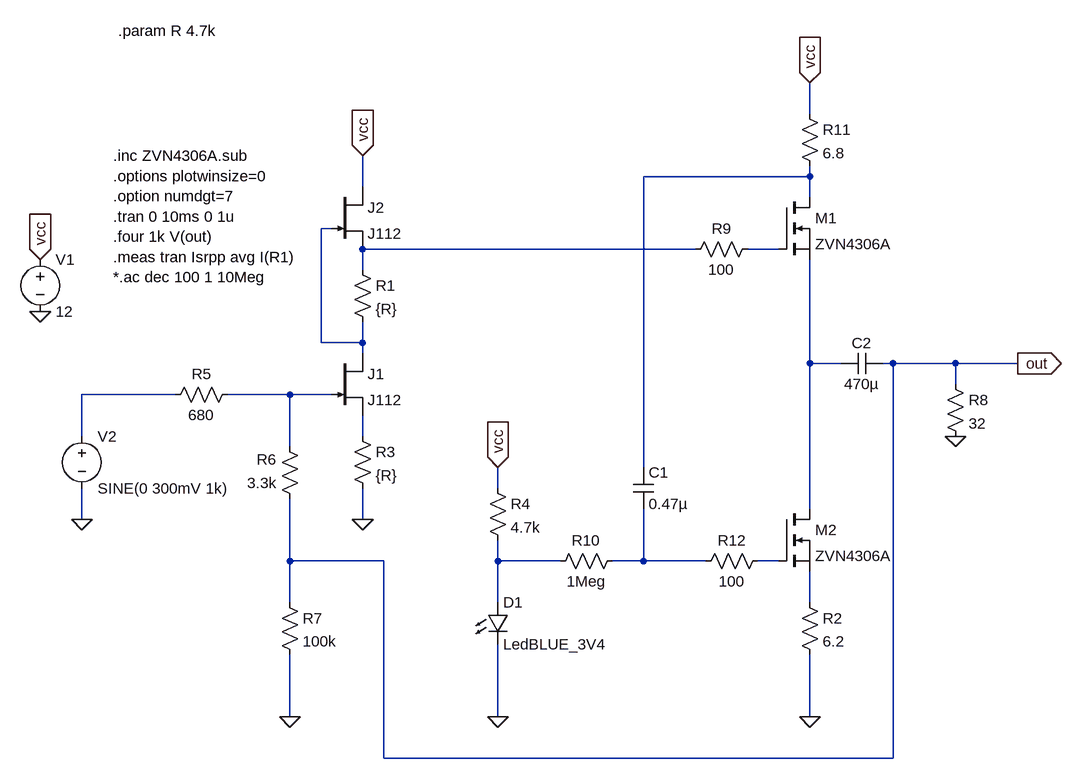
[diagram p0: schematic FET Only.asc]
FET Only.asc, the LTspice schematic file:
Version 4
SHEET 1 1460 884
WIRE 1056 -112 1056 -160
WIRE 1056 -16 1056 -32
WIRE 1056 -16 800 -16
WIRE 368 0 368 -48
WIRE 1056 16 1056 -16
WIRE 320 64 304 64
WIRE 880 96 368 96
WIRE 1008 96 960 96
WIRE 368 128 368 96
WIRE 304 240 304 64
WIRE 368 240 368 208
WIRE 368 240 304 240
WIRE 368 256 368 240
WIRE 1056 272 1056 112
WIRE 1104 272 1056 272
WIRE 1184 272 1168 272
WIRE 1280 272 1184 272
WIRE 1376 272 1280 272
WIRE 1280 304 1280 272
WIRE 80 320 -64 320
WIRE 256 320 160 320
WIRE 320 320 256 320
WIRE -64 384 -64 320
WIRE 368 384 368 352
WIRE 256 400 256 320
WIRE 800 432 800 -16
WIRE 576 464 576 432
WIRE 1056 496 1056 272
WIRE -64 512 -64 464
WIRE 368 512 368 464
WIRE 256 576 256 480
WIRE 400 576 256 576
WIRE 576 576 576 544
WIRE 672 576 576 576
WIRE 800 576 800 496
WIRE 800 576 752 576
WIRE 896 576 800 576
WIRE 1008 576 976 576
WIRE 256 640 256 576
WIRE 576 640 576 576
WIRE 1056 640 1056 592
WIRE 256 816 256 720
WIRE 576 816 576 704
WIRE 1056 816 1056 720
WIRE 400 880 400 576
WIRE 1184 880 1184 272
WIRE 1184 880 400 880
FLAG 368 512 0
FLAG -64 512 0
FLAG -128 112 vcc
IOPIN -128 112 In
FLAG -128 192 0
FLAG 368 -48 vcc
IOPIN 368 -48 In
FLAG 1056 -160 vcc
IOPIN 1056 -160 In
FLAG 1056 816 0
FLAG 576 432 vcc
IOPIN 576 432 In
FLAG 576 816 0
FLAG 1376 272 out
IOPIN 1376 272 Out
FLAG 256 816 0
FLAG 1280 384 0
SYMBOL voltage -64 368 R0
SYMATTR InstName V2
SYMATTR Value SINE(0 300mV 1k)
SYMATTR Value2 AC 1
SYMBOL voltage -128 96 R0
SYMATTR InstName V1
SYMATTR Value 12
SYMBOL res 352 368 R0
SYMATTR InstName R3
SYMATTR Value {R}
SYMBOL njf 320 256 R0
SYMATTR InstName J1
SYMATTR Value J112
SYMBOL res 352 112 R0
SYMATTR InstName R1
SYMATTR Value {R}
SYMBOL njf 320 0 R0
SYMATTR InstName J2
SYMATTR Value J112
SYMBOL res 1040 624 R0
SYMATTR InstName R2
SYMATTR Value 6.2
SYMBOL res 560 448 R0
SYMATTR InstName R4
SYMATTR Value 4.7k
SYMBOL nmos 1008 16 R0
SYMATTR InstName M1
SYMATTR Value ZVN4306A
SYMATTR Prefix X
SYMBOL res 176 304 R90
WINDOW 0 0 56 VBottom 2
WINDOW 3 32 56 VTop 2
SYMATTR InstName R5
SYMATTR Value 680
SYMBOL res 272 496 R180
WINDOW 0 36 76 Left 2
WINDOW 3 36 40 Left 2
SYMATTR InstName R6
SYMATTR Value 3.3k
SYMBOL res 240 624 R0
SYMATTR InstName R7
SYMATTR Value 100k
SYMBOL cap 1168 256 R90
WINDOW 0 0 32 VBottom 2
WINDOW 3 32 32 VTop 2
SYMATTR InstName C2
SYMATTR Value 470µ
SYMBOL res 1264 288 R0
SYMATTR InstName R8
SYMATTR Value 32
SYMBOL res 976 80 R90
WINDOW 0 0 56 VBottom 2
WINDOW 3 32 56 VTop 2
SYMATTR InstName R9
SYMATTR Value 100
SYMBOL res 768 560 R90
WINDOW 0 0 56 VBottom 2
WINDOW 3 32 56 VTop 2
SYMATTR InstName R10
SYMATTR Value 1Meg
SYMBOL res 1040 -128 R0
SYMATTR InstName R11
SYMATTR Value 6.8
SYMBOL cap 784 432 R0
SYMATTR InstName C1
SYMATTR Value 0.47µ
SYMBOL nmos 1008 496 R0
SYMATTR InstName M2
SYMATTR Value ZVN4306A
SYMATTR Prefix X
SYMBOL LED 560 640 R0
SYMATTR InstName D1
SYMATTR Value LedBLUE_3V4
SYMBOL res 992 560 R90
WINDOW 0 0 56 VBottom 2
WINDOW 3 32 56 VTop 2
SYMATTR InstName R12
SYMATTR Value 100
TEXT -16 -48 Left 2 !.inc ZVN4306A.sub\n.options plotwinsize=0\n.option numdgt=7\n.tran 0 10ms 0 1u\n.four 1k V(out)\n.meas tran Isrpp avg I(R1)\n*.ac dec 100 1 10Meg
TEXT -8 -240 Left 2 !.param R 4.7k

The netlist it stands for:
* FET Only.asc
V2 N006 0 SINE(0 300mV 1k) AC 1
V1 vcc 0 12
R3 N008 0 {R}
J1 N002 N007 N008 J112
R1 N003 N002 {R}
J2 vcc N002 N003 J112
R2 N012 0 6.2
R4 vcc N009 4.7k
XM1 N001 N004 N005 ZVN4306A  ; pins D G S
R5 N007 N006 680
R6 out N007 3.3k
R7 out 0 100k
C2 out N005 470µ
R8 out 0 32
R9 N004 N003 100
R10 N010 N009 1Meg
R11 vcc N001 6.8
C1 N001 N010 0.47µ
XM2 N005 N011 N012 ZVN4306A  ; pins D G S
D1 N009 0 LedBLUE_3V4
R12 N011 N010 100
.model D D
.lib standard.dio
.model NJF NJF
.model PJF PJF
.lib standard.jft
.inc ZVN4306A.sub
.options plotwinsize=0
.option numdgt=7
.tran 0 10ms 0 1u
.four 1k V(out)
.meas tran Isrpp avg I(R1)
*.ac dec 100 1 10Meg
.param R 4.7k
.backanno
.end